# EasyEDA Pro project Circuit-Design.eprj

# Schematic Schematic1
Board Name: Board1; Create Date: 2026-05-06; Page Name: P1; Project Name: Circuit-Design; Schematic Name: Schematic1; Update Date: 2026-05-06; Page Size: A4; Version: V1.0
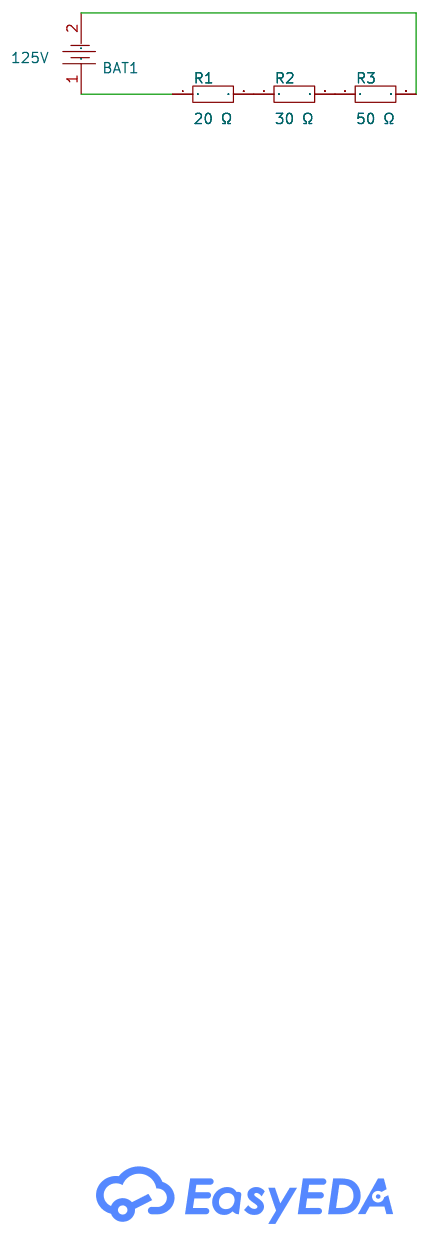
[diagram p0: schematic sheet]

## Parts
BAT1  125V  [BAT-TH_CR2032]
R1  20 Ω  [R0603]
R2  30 Ω  [R0603]
R3  50 Ω  [R0603]

## Library data of the parts
BAT1 = Q&J CR2032 20-6*9_C9900112302: LCSC Part Name: Q&J CR2032 20-6*9; Supplier Part: C9900112302; Manufacturer Part: Q&J CR2032 20-6*9; JLCPCB Part Class: Extended Part; Supplier: LCSC; Check: true
R1-R3 = Res_0603: Supplier Footprint: 0603; Check: true

## Nets
Net-(BAT1-1): BAT1.1 R1.1
Net-(BAT1-2): BAT1.2 R3.2
Net-(R1-2): R1.2 R2.1
Net-(R2-2): R2.2 R3.1

# Schematic Schematic2
Create Date: 2026-05-06; Page Name: P1; Project Name: Circuit-Design; Schematic Name: Schematic2; Update Date: 2026-05-06; Company: EasyEDA.com; Page Size: A4; Version: V1.0
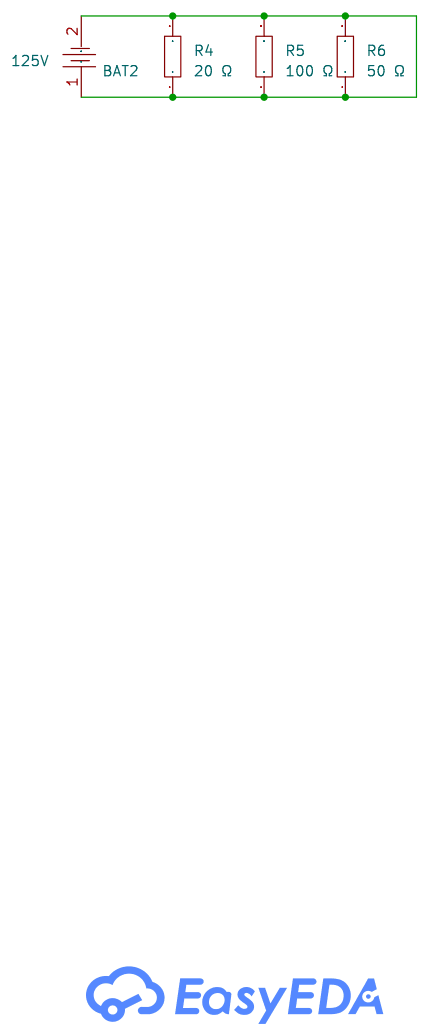
[diagram p1: schematic sheet]

## Parts
BAT2  125V  [BAT-TH_CR2032]
R4  20 Ω  [R0603]
R5  100 Ω  [R0603]
R6  50 Ω  [R0603]

## Library data of the parts
BAT2 = Q&J CR2032 20-6*9_C9900112302: LCSC Part Name: Q&J CR2032 20-6*9; Supplier Part: C9900112302; Manufacturer Part: Q&J CR2032 20-6*9; JLCPCB Part Class: Extended Part; Supplier: LCSC; Check: true
R4-R6 = Res_0603: Supplier Footprint: 0603; Check: true

## Nets
Net-(BAT2-1): BAT2.1 BAT2.2 R4.1 R4.2 R5.1 R5.2 R6.1 R6.2

# Schematic an Arduino Nano microcontroller
Create Date: 2026-05-06; Page Name: P1; Project Name: Circuit-Design; Schematic Name: an Arduino Nano microcontroller; Update Date: 2026-05-06; Company: EasyEDA.com; Page Size: A4; Version: V1.0
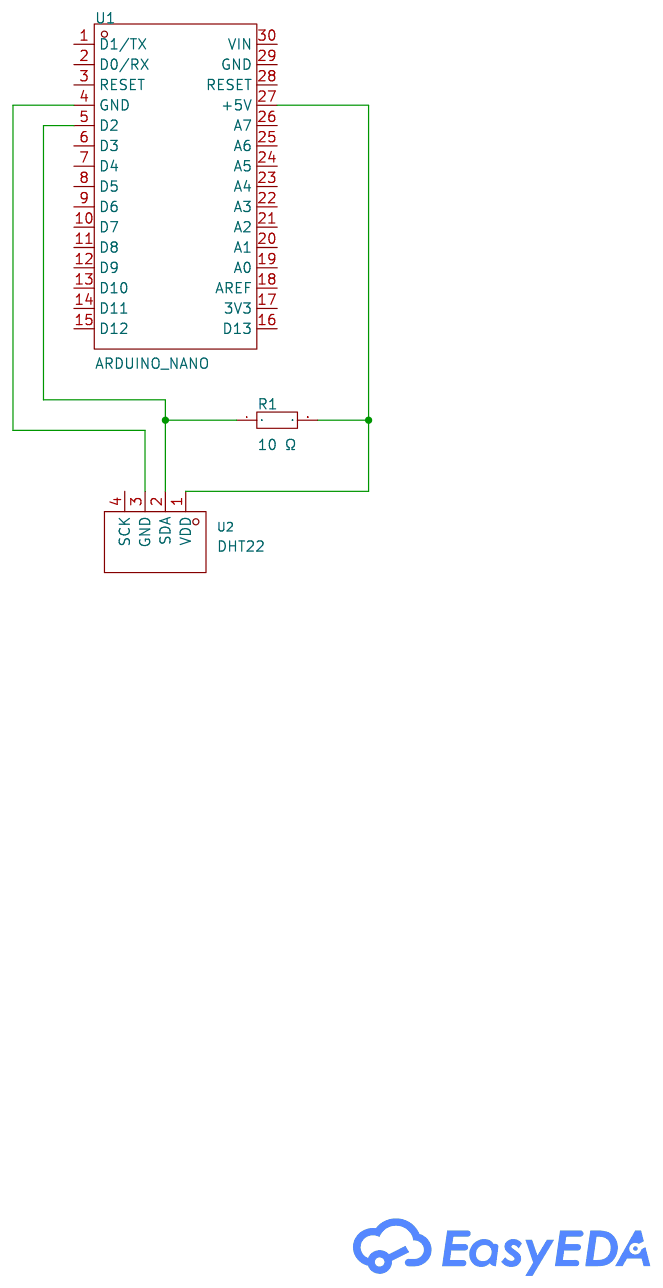
[diagram p2: schematic sheet]

## Parts
R1  10 Ω  [R0603]
U1  ARDUINO_NANO  [COMM-TH_ARDUINO_NANO]
U2  DHT22  [SENSOR-TH_HAIGU_DHT22]

## Library data of the parts
R1 = Res_0603: Supplier Footprint: 0603
U1 = ARDUINO_NANO: Supplier Part: C9900017879; Supplier Footprint: 插件; JLCPCB Part Class: Extended Part; Supplier: LCSC
U2 = DHT22: LCSC Part Name: 数字温湿度模块12mm*15.5mm*5.9mm; Supplier Part: C2880291; Manufacturer: HAIGU(广州海谷); Supplier Footprint: 插件; JLCPCB Part Class: Extended Part; Datasheet: https://atta.szlcsc.com/upload/public/pdf/source/20230523/7507864DBB8AF99FF82B5DD1568971DB.pdf; Supplier: LCSC; Temperature: -40℃~+80℃; Humidity: 5%RH~99%RH; Supply Voltage: 3.3V; Supply Current: 500uA; Resolution: ±3%RH

## Nets
Net-(R1-1): R1.1 U1.5(D2) U2.2(SDA)
Net-(R1-2): R1.2 U1.27(+5V) U2.1(VDD)
Net-(U1-4): U1.4(GND) U2.3(GND)

Not connected (* = marked no-connect by the designer): U1 1(D1/TX) 2(D0/RX) 3(RESET) 6(D3) 7(D4) 8(D5) 9(D6) 10(D7) 11(D8) 12(D9) 13(D10) 14(D11) 15(D12) 16(D13) 17(3V3) 18(AREF) 19(A0) 20(A1) 21(A2) 22(A3) 23(A4) 24(A5) 25(A6) 26(A7) 28(RESET) 29(GND) 30(VIN); U2 4(SCK)
